# EasyEDA Pro project ProPrj_FISCuntrol Board2-CAN_2026-07-03.epro

# Schematic FISCuntrol Board2-CAN
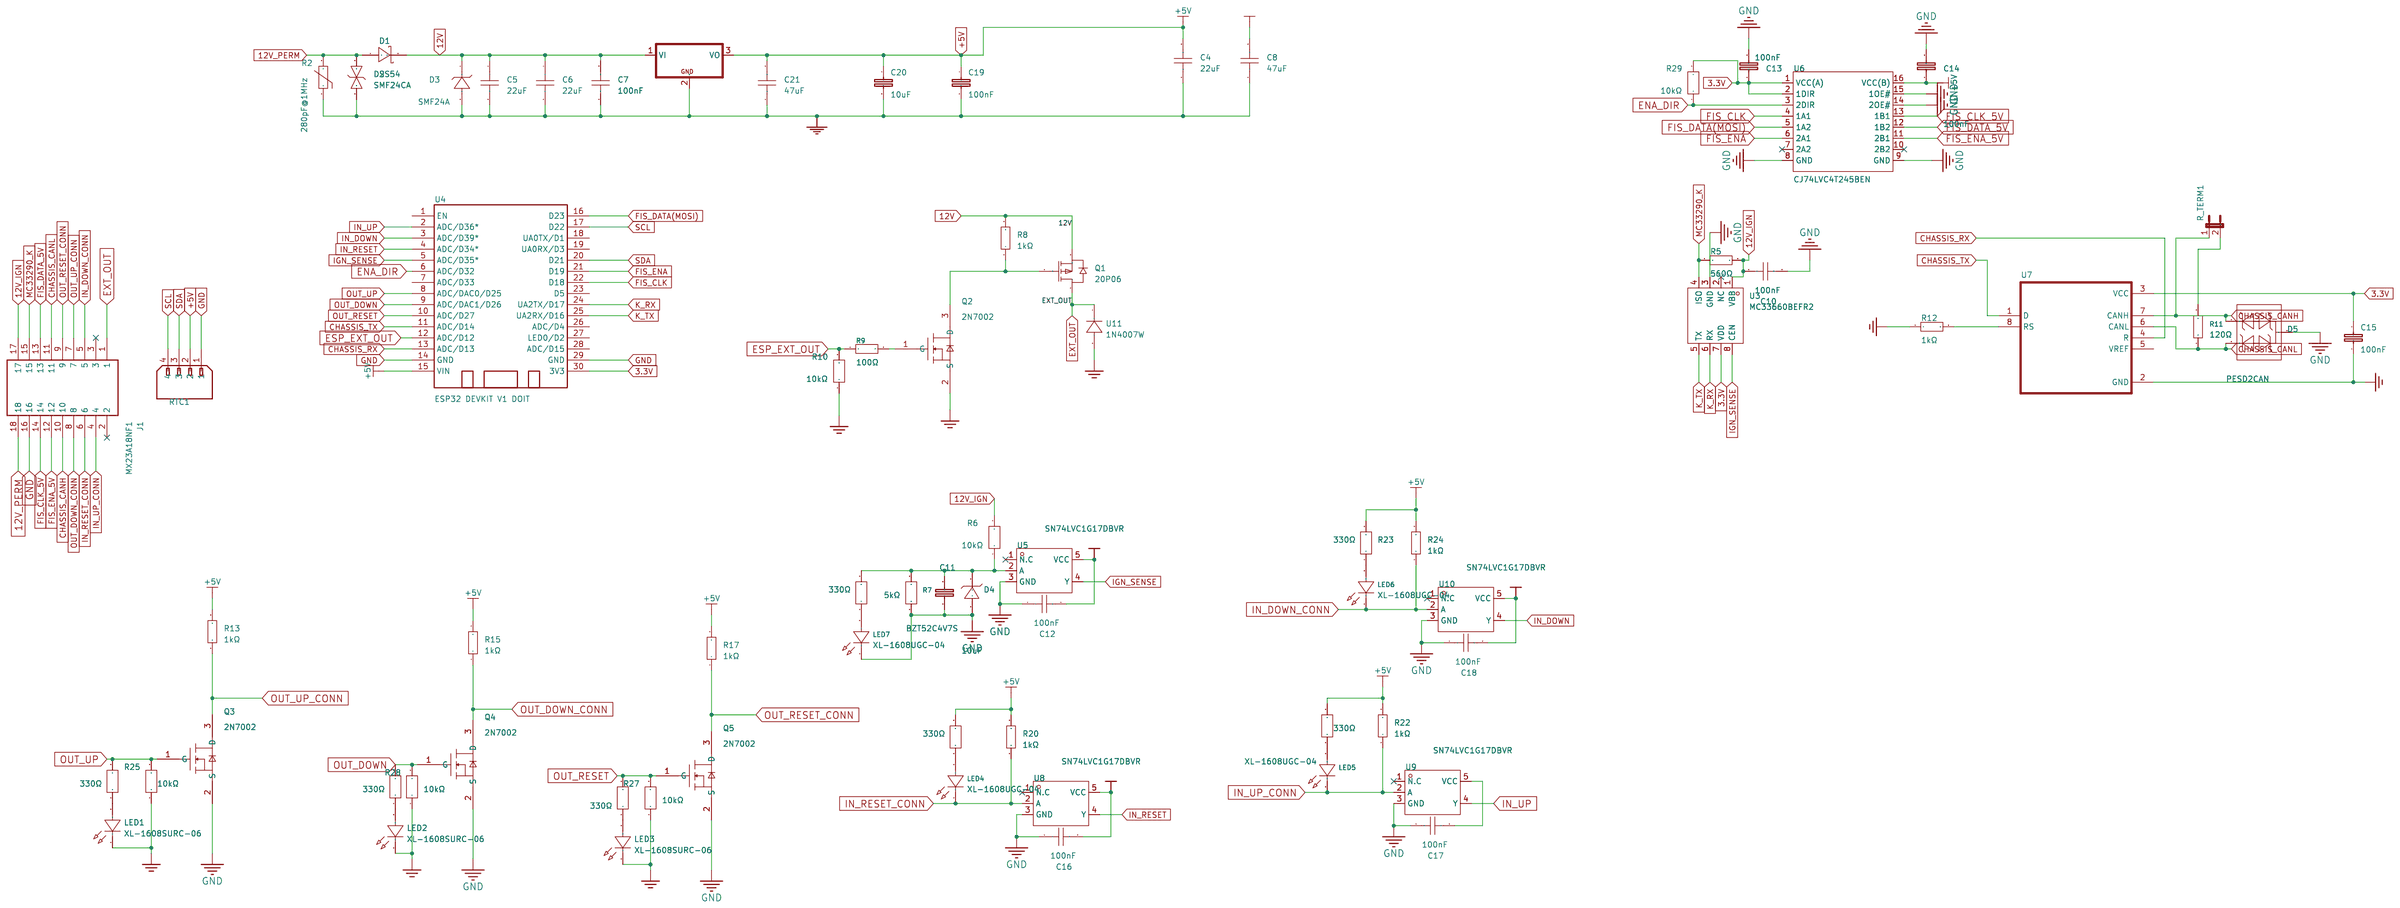
[diagram p0: schematic sheet]

## Parts
C4  22uF  [C0805]
C5  22uF  [C0805]
C6  22uF  [C0805]
C7  100nF  [C0603]
C8  47uF  [C0805]
C10  100nF  [C0603]
C11  10uF  [C0805]
C12  100nF  [C0603]
C13  100nF  [C0805]
C14  100nF  [C0805]
C15  100nF  [C0805]
C16  100nF  [C0603]
C17  100nF  [C0603]
C18  100nF  [C0603]
C19  100nF  [C0805]
C20  10uF  [C0805]
C21  47uF  [C0805]
D1  SS54  [SMA_L4.4-W2.8-LS5.4-R-RD]
D2  SMF24CA  [SOD-123FL_L2.8-W1.8-LS3.7-BI]
D3  SMF24A  [SOD-123FL_L2.7-W1.8-LS3.8-RD]
D4  BZT52C4V7S  [SOD-323_L1.8-W1.3-LS2.5-RD]
D5  PESD2CAN  [SOT-23-3_L2.9-W1.3-P1.90-LS2.4-BR]
IC1  L7805ABD2T-TR  [TO-263-2_L10.0-W9.2-P5.08-LS15.3-TL-CW]
J1  MX23A18NF1  [CONN-TH_18P-P2.50_MX23A18NF1]
LED1  XL-1608SURC-06  [LED0603-RD_RED]
LED2  XL-1608SURC-06  [LED0603-RD_RED]
LED3  XL-1608SURC-06  [LED0603-RD_RED]
LED4  XL-1608UGC-04  [LED0603-RD_GREEN]
LED5  XL-1608UGC-04  [LED0603-RD_GREEN]
LED6  XL-1608UGC-04  [LED0603-RD_GREEN]
LED7  XL-1608UGC-04  [LED0603-RD_GREEN]
Q1  20P06  [TO-252-2_L6.6-W6.1-P4.57-LS9.9-BR-CW]
Q2  2N7002  [SOT-23-3_L2.9-W1.3-P1.90-LS2.4-BR]
Q3  2N7002  [SOT-23-3_L2.9-W1.3-P1.90-LS2.4-BR]
Q4  2N7002  [SOT-23-3_L2.9-W1.3-P1.90-LS2.4-BR]
Q5  2N7002  [SOT-23-3_L2.9-W1.3-P1.90-LS2.4-BR]
R2  280pF@1MHz  [R0805]
R5  560Ω  [R0603]
R6  10kΩ  [R0603]
R7  5kΩ  [R0603]
R8  1kΩ  [R0603]
R9  100Ω  [R0603]
R10  10kΩ  [R0603]
R11  120Ω  [R0603]
R12  1kΩ  [R0603]
R13  1kΩ  [R0603]
R14  330Ω  [R0603]
R15  1kΩ  [R0603]
R16  330Ω  [R0603]
R17  1kΩ  [R0603]
R18  330Ω  [R0603]
R19  330Ω  [R0603]
R20  1kΩ  [R0603]
R21  330Ω  [R0603]
R22  1kΩ  [R0603]
R23  330Ω  [R0603]
R24  1kΩ  [R0603]
R25  10kΩ  [R0603]
R27  10kΩ  [R0603]
R28  10kΩ  [R0603]
R29  10kΩ  [R0603]
R30  330Ω  [R0603]
R_TERM1  PZ254V-11-02P  [HDR-TH_2P-P2.54-V-M]
RTC1  B4B-XH-A(LF)(SN)  [CONN-TH_B4B-XH-A-LF-SN]
U3  MC33660BEFR2  [SOIC-8_L5.0-W4.0-P1.27-LS6.0-BL]
U4  ESP32 DEVKIT V1 DOIT  [DOIT-ESP32-DEVKIT-V1]
U5  SN74LVC1G17DBVR  [SOT-23-5_L3.0-W1.5-P0.95-LS2.8-BL]
U6  CJ74LVC4T245BEN  [TSSOP-16_L5.0-W4.4-P0.65-LS6.4-BL-1]
U7  SN65HVD230DR  [SOIC-8_L4.9-W3.9-P1.27-LS6.0-BL]
U8  SN74LVC1G17DBVR  [SOT-23-5_L3.0-W1.5-P0.95-LS2.8-BL]
U9  SN74LVC1G17DBVR  [SOT-23-5_L3.0-W1.5-P0.95-LS2.8-BL]
U10  SN74LVC1G17DBVR  [SOT-23-5_L3.0-W1.5-P0.95-LS2.8-BL]
U11  1N4007W  [SOD-123FL_L2.7-W1.8-LS3.7-RD]

## Library data of the parts
C4-C6 = HGC0805R5226M350NSLJ: Capacitance: Tolerance:±20% Tolerance:±20% Voltage Rated: Temperature Coefficient:; LCSC Part Name: 22uF ±20% 35V; Supplier Part: C22367832; Manufacturer: Chinocera(华瓷); Supplier Footprint: 0805; JLCPCB Part Class: Extended Part; Datasheet: https://atta.szlcsc.com/upload/public/pdf/source/20240326/E9E9157D170E907C889ABA1F54A94302.pdf; Supplier: LCSC; Tolerance: ±20%; Standardization Check: false
C7 C10 C12 C16-C18 = CL10B104KB8NNNC: Capacitance:100nF Tolerance:±10% Tolerance:±10% Voltage Rating:50V Temperature Coefficient:X7R; LCSC Part Name: 100nF ±10% 50V; Supplier Part: C1591; Manufacturer: SAMSUNG(三星); Supplier Footprint: 0603; JLCPCB Part Class: Extended Part; Datasheet: https://item.szlcsc.com/datasheet/CL10B104KB8NNNC/1943.html; Supplier: LCSC; Tolerance: ±10%; Voltage Rating: 50V; Temperature Coefficient: X7R
C8 C21 = CL21A476MPYNNWE: Capacitance:47uF Tolerance:±20% Tolerance:±20% Voltage Rating:10V Temperature Coefficient:X5R; LCSC Part Name: 47uF ±20% 10V; Supplier Part: C5596752; Manufacturer: SAMSUNG(三星); Supplier Footprint: 0805; JLCPCB Part Class: Extended Part; Datasheet: https://item.szlcsc.com/datasheet/CL21A476MPYNNWE/6515219.html; Supplier: LCSC; Tolerance: ±20%; Voltage Rating: 10V; Temperature Coefficient: X5R
C11 C20 = CL21A106KAYNNNE_C15850: Capacitance: Tolerance:±10% Tolerance:±10% Voltage Rated: Temperature Coefficient:; LCSC Part Name: 10uF ±10% 25V; Supplier Part: C15850; Manufacturer: SAMSUNG(三星); Manufacturer Part: CL21A106KAYNNNE; Supplier Footprint: 0805; JLCPCB Part Class: Basic Part; Datasheet: https://atta.szlcsc.com/upload/public/pdf/source/20160218/1457707763339.pdf; Supplier: LCSC; Tolerance: ±10%
C13-C15 C19 = CT41G-0805-2X1-50V-0.1μF-K(N): Capacitance:100nF Tolerance:±10% Tolerance:±10% Voltage Rating:50V Temperature Coefficient:-; LCSC Part Name: 100nF ±10% 50V; Supplier Part: C126469; Manufacturer: TORCH(火炬); Supplier Footprint: 0805; JLCPCB Part Class: Extended Part; Datasheet: https://atta.szlcsc.com/upload/public/pdf/source/20171225/C150708_15141883600121203188.pdf; Supplier: LCSC; Tolerance: ±10%; Voltage Rating: 50V
D1 = SS54_C22452: Diode Configuration:Independent Type Forward Voltage (Vf@If):550mV@5A Reverse Voltage (Vr):40V Rectified Current:5A Reverse Leakage Current (Ir):1mA@40V; LCSC Part Name: 电压:40V 电流:5A; Supplier Part: C22452; Manufacturer: MDD(辰达半导体); Supplier Footprint: SMA(DO-214AC); JLCPCB Part Class: Basic Part; Datasheet: https://atta.szlcsc.com/upload/public/pdf/source/20240710/73DFBB65C1883B895E62D589679033DF.pdf; Supplier: LCSC; Diode Configuration: Independent Type; Forward Voltage (Vf@If): 550mV@5A; Reverse Voltage (Vr): 40V; Rectified Current: 5A; Reverse Leakage Current (Ir): 1mA@40V
D2 = SMF24CA_C353294: Reverse Stand-Off Voltage (Vrwm):24V Maximum Clamping Voltage:38.9V Peak Pulse Current (Ipp)@10/1000us:5.1A Breakdown Voltage:26.7V Reverse Leakage Current (Ir):1uA Type:TVS; Supplier Part: C353294; Manufacturer: 晶导微电子; Supplier Footprint: SOD-123FL; JLCPCB Part Class: Extended Part; Datasheet: https://atta.szlcsc.com/upload/public/pdf/source/20201106/C438024_76561727B84E8C9F41A4B4461A8AA838.pdf; Supplier: LCSC; Reverse Stand-Off Voltage (Vrwm): 24V; Maximum Clamping Voltage: 38.9V; Peak Pulse Current (Ipp)@10/1000us: 5.1A; Breakdown Voltage: 26.7V; Reverse Leakage Current (Ir): 1uA; Type: TVS
D3 = SMF24A_C19077514: Polarity:Unidirectional Reverse Stand-Off Voltage (Vrwm):24V Clamping Voltage:38.9V Peak Pulse Current (Ipp):5.1A@10/1000us Peak Pulse Power Dissipation (Ppp):200W@10/1000us Voltage - Breakdown:29.5V Reverse Leakage Current (Ir):1uA Number of Channels:1.0; LCSC Part Name: 单向TVS 24V截止 峰值浪涌电流：5.1A@10/1000us; Supplier Part: C19077514; Manufacturer: R+O(宏嘉诚); Supplier Footprint: SOD-123FL; JLCPCB Part Class: Extended Part; Datasheet: https://item.szlcsc.com/datasheet/SMF24A/20275599.html; Supplier: LCSC; Polarity: Unidirectional; Reverse Stand-Off Voltage (Vrwm): 24V; Clamping Voltage: 38.9V; Peak Pulse Current (Ipp): 5.1A@10/1000us; Peak Pulse Power Dissipation (Ppp): 200W@10/1000us; Voltage - Breakdown: 29.5V; Reverse Leakage Current (Ir): 1uA; Number of Channels: 1; Operating Temperature: -55℃~+150℃; level of protection: IEC 61000-4-2; Type: TVS
D4 = BZT52C4V7S_C353517: Diode Configuration:Independent Zener Voltage(Nom):4.7V Reverse Leakage Current (Ir):3uA@2V Zener Voltage(Range):4.4V~5V Zener Voltage(Range):4.4V~5V Pd - Power Dissipation:200mW Impedance(Zzt):80Ω Operating Junction Temperature Range:-55℃~+150℃ Operating; LCSC Part Name: 独立式 耐压:4.7V 电流:3uA@2V; Supplier Part: C353517; Manufacturer: 晶导微电子; Supplier Footprint: SOD-323; JLCPCB Part Class: Extended Part; Datasheet: https://item.szlcsc.com/datasheet/BZT52C4V7S/329266.html; Supplier: LCSC; Diode Configuration: Independent; Zener Voltage(Nom): 4.7V; Reverse Leakage Current (Ir): 3uA@2V; Zener Voltage(Range): 4.4V~5V; Pd - Power Dissipation: 200mW; Impedance(Zzt): 80Ω; Operating Junction Temperature Range: -55℃~+150℃
D5 = PESD2CAN_C907830: Polarity:Bidirectional Reverse Stand-Off Voltage (Vrwm):24V Clamping Voltage:50V Peak Pulse Current (Ipp):5.5A@8/20us Peak Pulse Power Dissipation (Ppp):250W@8/20us Voltage - Breakdown:32V Reverse Leakage Current (Ir):80nA Number of Channels:2 Operating T; LCSC Part Name: 丝印为6Rt 双向ESD 24V截止 峰值浪涌电流：5.5A@8/20us; Supplier Part: C907830; Manufacturer: TECH PUBLIC(台舟); Supplier Footprint: SOT-23; JLCPCB Part Class: Extended Part; Datasheet: https://item.szlcsc.com/datasheet/PESD2CAN/973917.html; Supplier: LCSC; Polarity: Bidirectional; Reverse Stand-Off Voltage (Vrwm): 24V; Clamping Voltage: 50V; Peak Pulse Current (Ipp): 5.5A@8/20us; Peak Pulse Power Dissipation (Ppp): 250W@8/20us; Voltage - Breakdown: 32V; Reverse Leakage Current (Ir): 80nA; Number of Channels: 2; Operating Temperature: -55℃~+125℃; level of protection: IEC 61000-4-2；IEC 61000-4-4；IEC 61000-4-5; Type: ESD; Junction Capacitance: 17pF
IC1 = L7805ABD2T-TR: Output Type:Fixed Maximum Input Voltage:35V Output Voltage:5V Output Voltage:5V Output Current:1.5A Power Supply Rejection Ratio (PSRR):68dB@(120Hz) Dropout Voltage:2V@(1A) standby current:6mA Feature:Short-Circuit  Protection；Thermal Protection(TSD) Oper; LCSC Part Name: 正稳压器IC; Supplier Part: C86206; Manufacturer: ST(意法半导体); Supplier Footprint: TO-263-2; JLCPCB Part Class: Extended Part; Datasheet: https://atta.szlcsc.com/upload/public/pdf/source/20191219/C472632_C0855675BBC73B8C8E44EE1325AAD56A.pdf; Supplier: LCSC; Output Type: Fixed; Maximum Input Voltage: 35V; Output Voltage: 5V; Output Current: 1.5A; Power Supply Rejection Ratio (PSRR): 68dB@(120Hz); Dropout Voltage: 2V@(1A); standby current: 6mA; Feature: Short-Circuit  Protection；Thermal Protection(TSD); Operating Temperature: -40℃~+125℃; Output Polarity: Positive electrode; Number of Outputs: 1
J1 = MX23A18NF1: Supplier Part: C2977290; Manufacturer: JAE(日本航空电子); Supplier Footprint: 插件; JLCPCB Part Class: Extended Part; Datasheet: https://item.szlcsc.com/datasheet/MX23A18NF1/3386696.html; Supplier: LCSC
LED1-LED3 = XL-1608SURC-06: Lamp Holder Type:1.6mm x 0.8mm square LED Illumination Color:Red Voltage - Forward(Vf):2.3V Voltage - Forward(Vf):2.3V Power(Watts):50mW Forward Current:20mA Wavelength - Dominant:620nm~630nm Wavelength - Dominant:620nm~630nm Peak Wavelength:625nm Peak Wa; LCSC Part Name: 0603红色贴片式发光二极管; Supplier Part: C965799; Manufacturer: XINGLIGHT(成兴光); Supplier Footprint: 0603; JLCPCB Part Class: Extended Part; Datasheet: https://item.szlcsc.com/datasheet/XL-1608SURC-06/1051408.html; Supplier: LCSC; Lamp Holder Type: 1.6mm x 0.8mm square LED; Illumination Color: Red; Voltage - Forward(Vf): 2.3V; Power(Watts): 50mW; Forward Current: 20mA; Wavelength - Dominant: 620nm~630nm; Peak Wavelength: 625nm; Diode Configuration: Discrete Diode; Lens Color: Water Clear; Luminous Intensity: 225mcd; Viewing Angle: 120°; Mounting Style: Top-mount; Operating Temperature: -40℃~+85℃
LED4-LED7 = XL-1608UGC-04: Lamp Holder Type:1.6mm x 0.8mm square LED Illumination Color:Emerald Green Voltage - Forward(Vf):3.3V Voltage - Forward(Vf):3.3V Power(Watts):70mW Forward Current:20mA Wavelength - Dominant:515nm~535nm Wavelength - Dominant:515nm~535nm Peak Wavelength:525; LCSC Part Name: 0603翠绿贴片式发光二极管; Supplier Part: C965804; Manufacturer: XINGLIGHT(成兴光); Supplier Footprint: 0603; JLCPCB Part Class: Extended Part; Datasheet: https://item.szlcsc.com/datasheet/XL-1608UGC-04/1051413.html; Supplier: LCSC; Lamp Holder Type: 1.6mm x 0.8mm square LED; Illumination Color: Emerald Green; Voltage - Forward(Vf): 3.3V; Power(Watts): 70mW; Forward Current: 20mA; Wavelength - Dominant: 515nm~535nm; Peak Wavelength: 525nm; Diode Configuration: Discrete Diode; Lens Color: Water Clear; Luminous Intensity: 810mcd; Viewing Angle: 120°; Mounting Style: Top-mount; Operating Temperature: -40℃~+85℃
Q1 = 20P06: Type:1 Piece P-Channel Drain Source Voltage (Vdss):60V Continuous Drain Current (Id): Drain Source On Resistance (RDS(on)@Vgs,Id):48mΩ Gate Threshold Voltage (Vgs(th)@Id):2.5V; LCSC Part Name: 1个P沟道 耐压:60V 电流:20A; Supplier Part: C18164394; Manufacturer: HL(富海微); Supplier Footprint: TO-252; JLCPCB Part Class: Extended Part; Datasheet: https://atta.szlcsc.com/upload/public/pdf/source/20231012/DDB4F5E9C77D3DD288E1321309E3ABAC.pdf; Supplier: LCSC; Type: 1 Piece P-Channel; Drain Source Voltage (Vdss): 60V; Drain Source On Resistance (RDS(on)@Vgs,Id): 48mΩ; Gate Threshold Voltage (Vgs(th)@Id): 2.5V
Q2-Q5 = 2N7002_C916396: Number:1 N-channel Drain to Source Voltage:60V Current - Continuous Drain(Id):115mA RDS(on):1.7Ω@5V Pd - Power Dissipation:200mW Gate Threshold Voltage (Vgs(th)):2.5V Gate Charge(Qg):- Input Capacitance(Ciss):50pF Reverse Transfer Capacitance (Crss@Vds):5; LCSC Part Name: 1个N沟道 耐压:60V 电流:115mA; Supplier Part: C916396; Manufacturer: JSMSEMI(杰盛微); Supplier Footprint: SOT-23; JLCPCB Part Class: Extended Part; Datasheet: https://item.szlcsc.com/datasheet/2N7002/990892.html; Supplier: LCSC; Number: 1 N-channel; Drain to Source Voltage: 60V; Current - Continuous Drain(Id): 115mA; RDS(on): 1.7Ω@5V; Pd - Power Dissipation: 200mW; Gate Threshold Voltage (Vgs(th)): 2.5V; Input Capacitance(Ciss): 50pF; Reverse Transfer Capacitance (Crss@Vds): 5pF; Operating Temperature: -55℃~+150℃
R2 = FPV201209E260PKT: Varistor Voltage:36V Varistor Voltage:36V Clamping Voltage:63V Maximum DC Volts:26V Maximum AC Volts:18.4V Peak Current:100A Energy:0.3J Energy:0.3J Capacitance:280pF@1MHz Rated Wattage:-; LCSC Part Name: 钳位电压63V 0.3焦耳 0805压敏电阻; Supplier Part: C2991545; Manufacturer: FH(风华); Supplier Footprint: 0805; JLCPCB Part Class: Extended Part; Datasheet: https://atta.szlcsc.com/upload/public/pdf/source/20181030/C304296_DDDABF933F96CAF6D0EBDDE0D30269D0.pdf; Supplier: LCSC; Varistor Voltage: 36V; Clamping Voltage: 63V; Maximum DC Volts: 26V; Maximum AC Volts: 18.4V; Peak Current: 100A; Energy: 0.3J
R5 = 0603WAF5600T5E: Type:Thick Film Resistor Resistance:560Ω Tolerance:±1% Tolerance:±1% Power(Watts):100mW Voltage-Supply(Max):75V Temperature Coefficient:±100ppm/℃ Temperature Coefficient:±100ppm/℃ Operating Temperature:-55℃~+155℃ Operating Temperature:-55℃~+155℃; LCSC Part Name: 560Ω ±1% 100mW 厚膜电阻; Supplier Part: C23204; Manufacturer: UNI-ROYAL(厚声); Supplier Footprint: 0603; JLCPCB Part Class: Basic Part; Datasheet: https://item.szlcsc.com/datasheet/0603WAF5600T5E/23931.html; Supplier: LCSC; Type: Thick Film Resistor; Tolerance: ±1%; Power(Watts): 100mW; Voltage-Supply(Max): 75V; Temperature Coefficient: ±100ppm/℃; Operating Temperature: -55℃~+155℃
R6 R10 R25 R27-R29 = FRC0603J103 TS: Type:Thick Film Resistor Resistance:10kΩ Tolerance:±5% Tolerance:±5% Power(Watts):100mW Voltage-Supply(Max):75V Temperature Coefficient:±100ppm/℃ Temperature Coefficient:±100ppm/℃ Operating Temperature:-55℃~+155℃ Operating Temperature:-55℃~+155℃; LCSC Part Name: 10kΩ ±5% 100mW 厚膜电阻; Supplier Part: C2930027; Manufacturer: FOJAN(富捷); Supplier Footprint: 0603; JLCPCB Part Class: Extended Part; Datasheet: https://item.szlcsc.com/datasheet/FRC0603J103%2520TS/3266960.html; Supplier: LCSC; Type: Thick Film Resistor; Tolerance: ±5%; Power(Watts): 100mW; Voltage-Supply(Max): 75V; Temperature Coefficient: ±100ppm/℃; Operating Temperature: -55℃~+155℃
R7 = RTT035001FTP: Type:Thick Film Resistor Resistance:5kΩ Tolerance:±1% Tolerance:±1% Power(Watts):100mW Voltage-Supply(Max):75V Temperature Coefficient:±100ppm/℃ Temperature Coefficient:±100ppm/℃ Operating Temperature:-55℃~+155℃ Operating Temperature:-55℃~+155℃; LCSC Part Name: 厚膜电阻 5kΩ ±1% 100mW; Supplier Part: C166926; Manufacturer: RALEC(旺诠); Supplier Footprint: 0603; JLCPCB Part Class: Extended Part; Datasheet: https://item.szlcsc.com/datasheet/RTT035001FTP/178309.html; Supplier: LCSC; Type: Thick Film Resistor; Tolerance: ±1%; Power(Watts): 100mW; Voltage-Supply(Max): 75V; Temperature Coefficient: ±100ppm/℃; Operating Temperature: -55℃~+155℃
R8 R12 R13 R15 R17 = 0603WAF1001T5E: Type:Thick Film Resistors Resistance:1kΩ Tolerance:±1% Tolerance:±1% Power(Watts): Overload Voltage (Max): Temperature Coefficient:±100ppm/℃ Temperature Coefficient:±100ppm/℃ Operating Temperature Range:-55℃~+155℃ Operating Temperature Range:-55℃~+155℃; LCSC Part Name: 1kΩ ±1% 100mW 厚膜电阻; Supplier Part: C21190; Manufacturer: UNI-ROYAL(厚声); Supplier Footprint: 0603; JLCPCB Part Class: Basic Part; Datasheet: https://atta.szlcsc.com/upload/public/pdf/source/20200306/C422600_1E6D84923E4A46A82E41ADD87F860B5C.pdf; Supplier: LCSC; Type: Thick Film Resistors; Tolerance: ±1%; Temperature Coefficient: ±100ppm/℃; Operating Temperature Range: -55℃~+155℃
R9 = 0603WAJ0101T5E: Type:Thick Film Resistor Resistance:100Ω Tolerance:±5% Tolerance:±5% Power(Watts):100mW Voltage-Supply(Max):75V Temperature Coefficient:±100ppm/℃ Temperature Coefficient:±100ppm/℃ Operating Temperature:-55℃~+155℃ Operating Temperature:-55℃~+155℃; LCSC Part Name: 100Ω ±5% 100mW 厚膜电阻; Supplier Part: C25201; Manufacturer: UNI-ROYAL(厚声); Supplier Footprint: 0603; JLCPCB Part Class: Extended Part; Datasheet: https://item.szlcsc.com/datasheet/0603WAJ0101T5E/25944.html; Supplier: LCSC; Type: Thick Film Resistor; Tolerance: ±5%; Power(Watts): 100mW; Voltage-Supply(Max): 75V; Temperature Coefficient: ±100ppm/℃; Operating Temperature: -55℃~+155℃
R11 = 0603WAF1200T5E: Type:Thick Film Resistors Resistance: Tolerance:±1% Tolerance:±1% Power(Watts): Overload Voltage (Max): Temperature Coefficient:±100ppm/℃ Temperature Coefficient:±100ppm/℃ Operating Temperature Range:-55℃~+155℃ Operating Temperature Range:-55℃~+155℃; LCSC Part Name: 120Ω ±1% 100mW 厚膜电阻; Supplier Part: C22787; Manufacturer: UNI-ROYAL(厚声); Supplier Footprint: 0603; JLCPCB Part Class: Basic Part; Datasheet: https://atta.szlcsc.com/upload/public/pdf/source/20200306/C422600_1E6D84923E4A46A82E41ADD87F860B5C.pdf; Supplier: LCSC; Type: Thick Film Resistors; Tolerance: ±1%; Temperature Coefficient: ±100ppm/℃; Operating Temperature Range: -55℃~+155℃
R14 R16 R18 R19 R21 R23 R30 = FRC0603J331 TS: Type:Thick Film Resistor Resistance:330Ω Tolerance:±5% Tolerance:±5% Power(Watts):100mW Voltage-Supply(Max):75V Temperature Coefficient:±100ppm/℃ Temperature Coefficient:±100ppm/℃ Operating Temperature:-55℃~+155℃ Operating Temperature:-55℃~+155℃; LCSC Part Name: 330Ω ±5% 100mW 厚膜电阻; Supplier Part: C2907152; Manufacturer: FOJAN(富捷); Supplier Footprint: 0603; JLCPCB Part Class: Extended Part; Supplier: LCSC; Type: Thick Film Resistor; Tolerance: ±5%; Power(Watts): 100mW; Voltage-Supply(Max): 75V; Temperature Coefficient: ±100ppm/℃; Operating Temperature: -55℃~+155℃
R20 R22 R24 = 0603WAF1001T5E: Type:Thick Film Resistors Resistance:1kΩ Tolerance:±1% Tolerance:±1% Power(Watts): Overload Voltage (Max): Temperature Coefficient:±100ppm/℃ Temperature Coefficient:±100ppm/℃ Operating Temperature Range:-55℃~+155℃ Operating Temperature Range:-55℃~+155℃; LCSC Part Name: 1kΩ ±1% 100mW 厚膜电阻; Supplier Part: C21190; Manufacturer: UNI-ROYAL(厚声); Supplier Footprint: 0603; JLCPCB Part Class: Basic Part; Datasheet: https://atta.szlcsc.com/upload/public/pdf/source/20200306/C422600_1E6D84923E4A46A82E41ADD87F860B5C.pdf; Supplier: LCSC; Type: Thick Film Resistors; Tolerance: ±1%; Temperature Coefficient: ±100ppm/℃; Operating Temperature Range: -55℃~+155℃; Check: true
R_TERM1 = PZ254V-11-02P: Pin Structure:1x2P Pitch:2.54mm Row Spacing:- Circluar Pins/Square Pins:Policy Mounting Type:Straight Number of Rows:Single Row Number of Pins:2P Current Rating:- Voltage Rating (Max):- Length of Mating Pin:6mm Insulation Height:2.5mm Length of End Connec; LCSC Part Name: 1x2P 间距:2.54mm 方针 直插; Supplier Part: C492401; Manufacturer: XFCN(兴飞); Supplier Footprint: 插件,P=2.54mm; JLCPCB Part Class: Extended Part; Datasheet: https://atta.szlcsc.com/upload/public/pdf/source/20200309/C492401_A812433581A9B211A7FFA413ADDFF0E5.pdf; Supplier: LCSC; Pin Structure: 1x2P; Pitch: 2.54mm; Circluar Pins/Square Pins: Policy; Mounting Type: Straight; Number of Rows: Single Row; Number of Pins: 2P; Length of Mating Pin: 6mm; Insulation Height: 2.5mm; Length of End Connection Pin: 3mm; Contact Material: Brass; Operating Temperature: -40℃~+105℃; Color: Black
RTC1 = B4B-XH-A(LF)(SN): Pins Structure:1x4P Pitch:2.5mm Mounting Type:Through Hole Reference Series:XH Number of Pins:4P Number of Rows:1 Number of PINs Per Row:4 Row Spacing:- Current Rating:3A Contact Material:Brass Contact Plating:Tin Operating Temperature:-25℃~+85℃ Operating; LCSC Part Name: 1x4P 间距:2.5mm 直插 系列:XH; Supplier Part: C144395; Manufacturer: JST; Supplier Footprint: 插件,P=2.5mm; JLCPCB Part Class: Extended Part; Datasheet: https://item.szlcsc.com/datasheet/B4B-XH-A(LF)(SN)/155727.html; Supplier: LCSC; Pins Structure: 1x4P; Pitch: 2.5mm; Mounting Type: Through Hole; Reference Series: XH; Number of Pins: 4P; Number of Rows: 1; Number of PINs Per Row: 4; Current Rating: 3A; Contact Material: Brass; Contact Plating: Tin; Operating Temperature: -25℃~+85℃; Voltage Rating: 250V; Plastic Material: PA66; Flame Retardant Rating: UL94V-0; Supplementary Features: K Pin; Color: White; Z-Height of the Board: 7mm; X-Length of Bottom Edge on Board (Spacing Line): 12.4mm; Y-Width of Bottom Edge on Board: 5.75mm
U3 = MC33660BEFR2: Voltage - Supply:8V~18V Voltage - Supply:8V~18V; LCSC Part Name: ISO K线串行链路接口; Supplier Part: C2652912; Manufacturer: NXP(恩智浦); Supplier Footprint: SOIC-8; JLCPCB Part Class: Extended Part; Datasheet: https://www.nxp.com/docs/en/data-sheet/MC33660.pdf; Supplier: LCSC; Voltage - Supply: 8V~18V
U4 = ESP32 DEVKIT V1 DOIT
U5 U8-U10 = SN74LVC1G17DBVR_C19829662: Supplier Part: C19829662; Manufacturer: TECH PUBLIC(台舟); Supplier Footprint: SOT-23-5; JLCPCB Part Class: Extended Part; Datasheet: https://atta.szlcsc.com/upload/public/pdf/source/20240202/EAF8B4F29332307745EEFE11873F995E.pdf; Supplier: LCSC
U6 = CJ74LVC4T245BEN: Channel Type:Bidirectional Input Signal:- Output Signal:- Data Rate:- Voltage - Supply(VCCA):1.2V~5.5V Voltage - Supply(VCCA):1.2V~5.5V Voltage - Supply(VCCB):1.2V~5.5V Voltage - Supply(VCCB):1.2V~5.5V Number of Elements:2 Number of Circuits:2 Output Type; LCSC Part Name: 4位双电源电平转换收发器，具备三态输出和双向电平转换功能，可作两个2位或一个4位收发器，适用于低电压节点间转换; Supplier Part: C52145709; Manufacturer: CJ(江苏长电/长晶); Supplier Footprint: TSSOP-16; JLCPCB Part Class: Extended Part; Datasheet: https://item.szlcsc.com/datasheet/CJ74LVC4T245BEN/54945864.html; Supplier: LCSC; Channel Type: Bidirectional; Voltage - Supply(VCCA): 1.2V~5.5V; Voltage - Supply(VCCB): 1.2V~5.5V; Number of Elements: 2; Number of Circuits: 2; Output Type: Tri-State; Operating Temperature: -40℃~+125℃; Features: Power-off protection；Output enable high-impedance
U7 = SN65HVD230DR: Type:CANtransceiver Data Rate:1Mbps Voltage - Supply:- Voltage - Supply:- Current - Supply:- Operating Temperature:-40℃~+85℃ Operating Temperature:-40℃~+85℃; LCSC Part Name: 3.3-V CAN 收发器; Supplier Part: C12084; Manufacturer: TI(德州仪器); Supplier Footprint: SOIC-8; JLCPCB Part Class: Extended Part; Datasheet: https://www.ti.com/cn/lit/gpn/sn65hvd230; Supplier: LCSC; Type: CANtransceiver; Data Rate: 1Mbps; Operating Temperature: -40℃~+85℃
U11 = 1N4007W_C7528871: Diode Configuration:Independent Voltage - Forward(Vf@If):1.1V@1A Voltage - DC Reverse(Vr):1kV Current - Rectified:1A Reverse Leakage Current (Ir):10uA Non-Repetitive Peak Forward Surge Current:- Operating Junction Temperature Range:-65℃~+150℃ Operating Ju; LCSC Part Name: 1kV 1A; Supplier Part: C7528871; Manufacturer: MSKSEMI(美森科); Supplier Footprint: SOD-123FL; JLCPCB Part Class: Extended Part; Datasheet: https://item.szlcsc.com/datasheet/1N4007W/8628271.html; Supplier: LCSC; Diode Configuration: Independent; Voltage - Forward(Vf@If): 1.1V@1A; Voltage - DC Reverse(Vr): 1kV; Current - Rectified: 1A; Reverse Leakage Current (Ir): 10uA; Operating Junction Temperature Range: -65℃~+150℃

## Nets
3.3V: C8.2 C12.2 C13.1 C15.1 C16.2 C17.2 C18.2 R29.2 U3.7(VDD) U4.30(3V3) U5.5(VCC) U6.1(VCC(A)) U6.2(1DIR) U7.3(VCC) U8.5(VCC) U9.5(VCC) U10.5(VCC)
12V: C5.1 C6.1 C7.2 D1.2(K) D3.1(K) IC1.1(VI) Q1.3(S) R8.2
12V_IGN: C10.1 J1.17 R5.2 R6.2 U3.1(VBB)
12V_PERM: D1.1(A) D2.2 J1.18 R2.2
+5V: C4.2 C14.1 C19.1 C20.1 C21.2 IC1.3(VO) R13.2 R15.2 R17.2 R19.2 R20.2 R21.2 R22.2 R23.2 R24.2 RTC1.2 U4.15(VIN) U6.16(VCC(B))
GND: C4.1 C5.2 C6.2 C7.1 C8.1 C10.2 C11.1 C12.1 C13.2 C14.2 C15.2 C16.1 C17.1 C18.1 C19.2 C20.2 C21.1 D2.1 D3.2(A) D4.2(A) D5.3 IC1.2(GND) J1.16 LED1.1(K) LED2.1(K) LED3.1(K) LED7.1(K) Q2.2(S) Q3.2(S) Q4.2(S) Q5.2(S) R2.1 R7.1 R10.1 R12.1 R25.1 R27.1 R28.1 RTC1.1 U3.3(GND) U4.14(GND) U4.29(GND) U5.3(GND) U6.8(GND) U6.9(GND) U6.14(2OE#) U6.15(1OE#) U7.2(GND) U8.3(GND) U9.3(GND) U10.3(GND) U11.2(A)
CHASSIS_CANH: D5.1 J1.10 R_TERM1.1 U7.7(CANH)
CHASSIS_CANL: D5.2 J1.11 R11.1 U7.6(CANL)
CHASSIS_RX: U4.13(ADC/D13) U7.4(R)
CHASSIS_TX: U4.11(ADC/D14) U7.1(D)
ENA_DIR: R29.1 U4.6(ADC/D32) U6.3(2DIR)
ESP_EXT_OUT: R9.1 R10.2 U4.12(ADC/D12)
EXT_OUT: J1.1 Q1.2(D) U11.1(K)
FIS_CLK: U4.22(D18) U6.4(1A1)
FIS_CLK_5V: J1.14 U6.13(1B1)
FIS_DATA(MOSI): U4.16(D23) U6.5(1A2)
FIS_DATA_5V: J1.13 U6.12(1B2)
FIS_ENA: U4.21(D19) U6.6(2A1)
FIS_ENA_5V: J1.12 U6.11(2B1)
IGN_SENSE: U3.8(CEN) U4.5(ADC/D35*) U5.4(Y)
IN_DOWN: U4.3(ADC/D39*) U10.4(Y)
IN_DOWN_CONN: J1.5 LED6.1(K) R24.1 U10.2(A)
IN_RESET: U4.4(ADC/D34*) U8.4(Y)
IN_RESET_CONN: J1.6 LED4.1(K) R20.1 U8.2(A)
IN_UP: U4.2(ADC/D36*) U9.4(Y)
IN_UP_CONN: J1.4 LED5.1(K) R22.1 U9.2(A)
K_RX: U3.6(RX) U4.24(UA2TX/D17)
K_TX: U3.5(TX) U4.25(UA2RX/D16)
MC33290_K: J1.15 R5.1 U3.4(ISO)
OUT_DOWN: Q4.1(G) R16.2 R28.2 U4.9(ADC/DAC1/D26)
OUT_DOWN_CONN: J1.8 Q4.3(D) R15.1
OUT_RESET: Q5.1(G) R18.2 R27.2 U4.10(ADC/D27)
OUT_RESET_CONN: J1.9 Q5.3(D) R17.1
OUT_UP: Q3.1(G) R14.2 R25.2 U4.8(ADC/DAC0/D25)
OUT_UP_CONN: J1.7 Q3.3(D) R13.1
SCL: RTC1.4 U4.17(D22)
SDA: RTC1.3 U4.20(D21)
$1N2670: R12.2 U7.8(RS)
$1N2676: R11.2 R_TERM1.2
$1N3031: C11.2 D4.1(K) R6.1 R7.2 R30.2 U5.2(A)
$1N10020: Q1.1(G) Q2.3(D) R8.1
$1N11639: Q2.1(G) R9.2
$1N29123: LED6.2(A) R23.1
$1N29127: LED5.2(A) R21.1
$1N29131: LED4.2(A) R19.1
$1N35050: LED1.2(A) R14.1
$1N35143: LED2.2(A) R16.1
$1N35226: LED3.2(A) R18.1
$1N45097: LED7.2(A) R30.1

Not connected (* = marked no-connect by the designer): J1 2* 3*; U3 2(NC)*; U4 1(EN) 7(ADC/D33) 18(UA0TX/D1) 19(UA0RX/D3) 23(D5) 26(ADC/D4) 27(LED0/D2) 28(ADC/D15); U5 1(N.C)*; U6 7(2A2)* 10(2B2)*; U7 5(VREF); U8 1(N.C)*; U9 1(N.C)*; U10 1(N.C)*

# Board PCB1
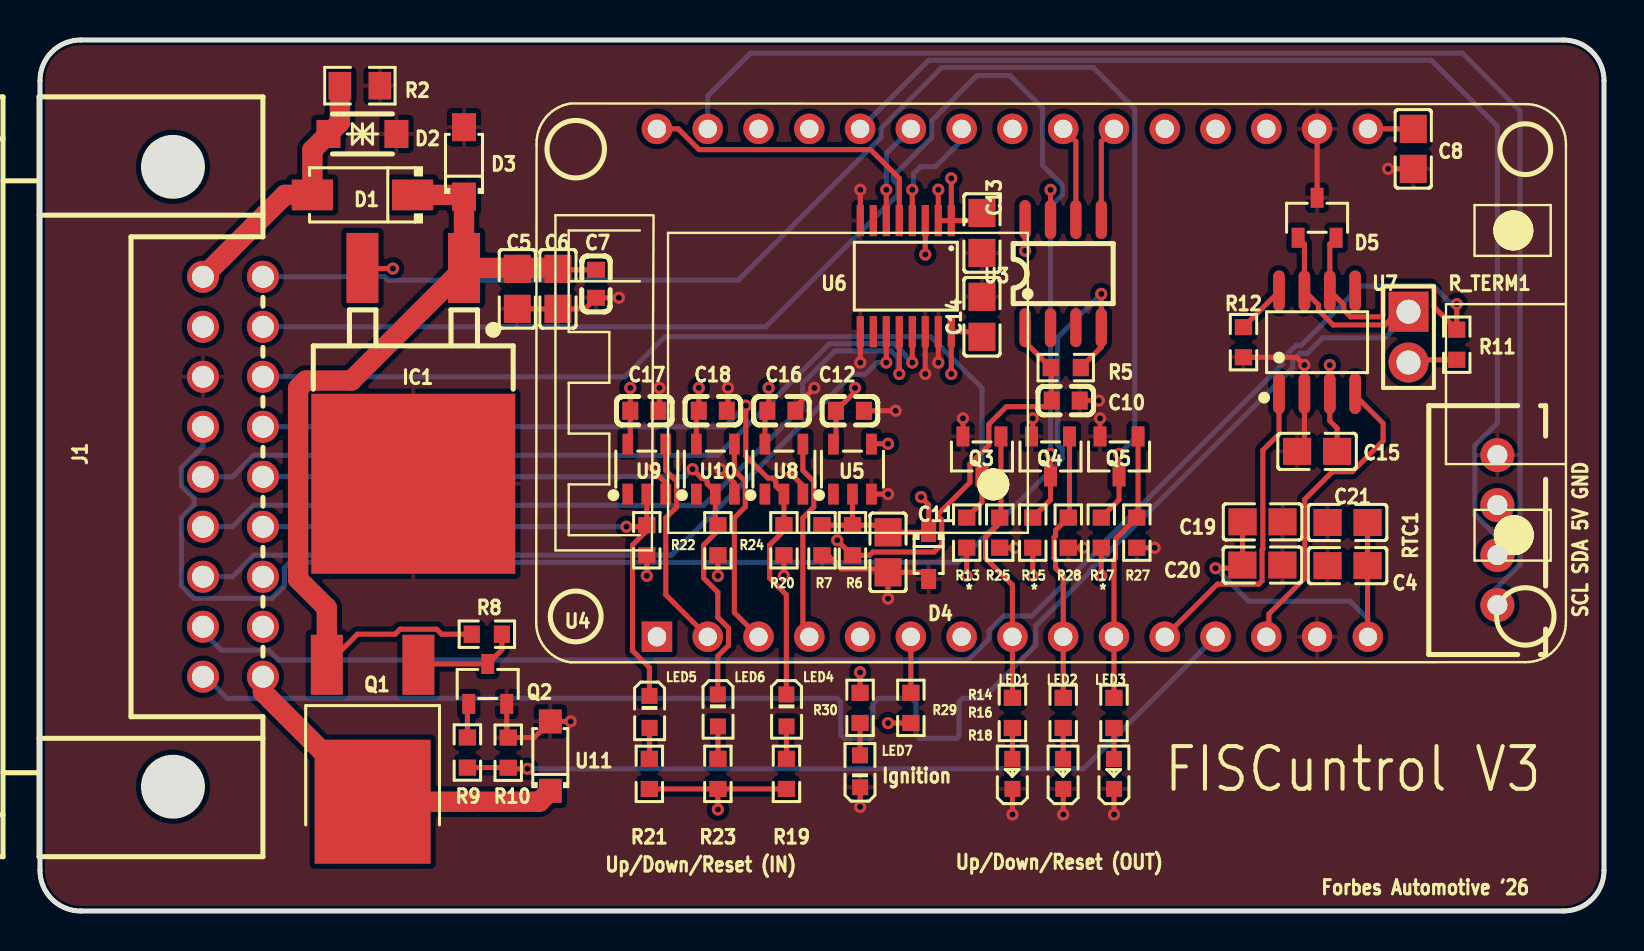
[diagram p1: board, top side]
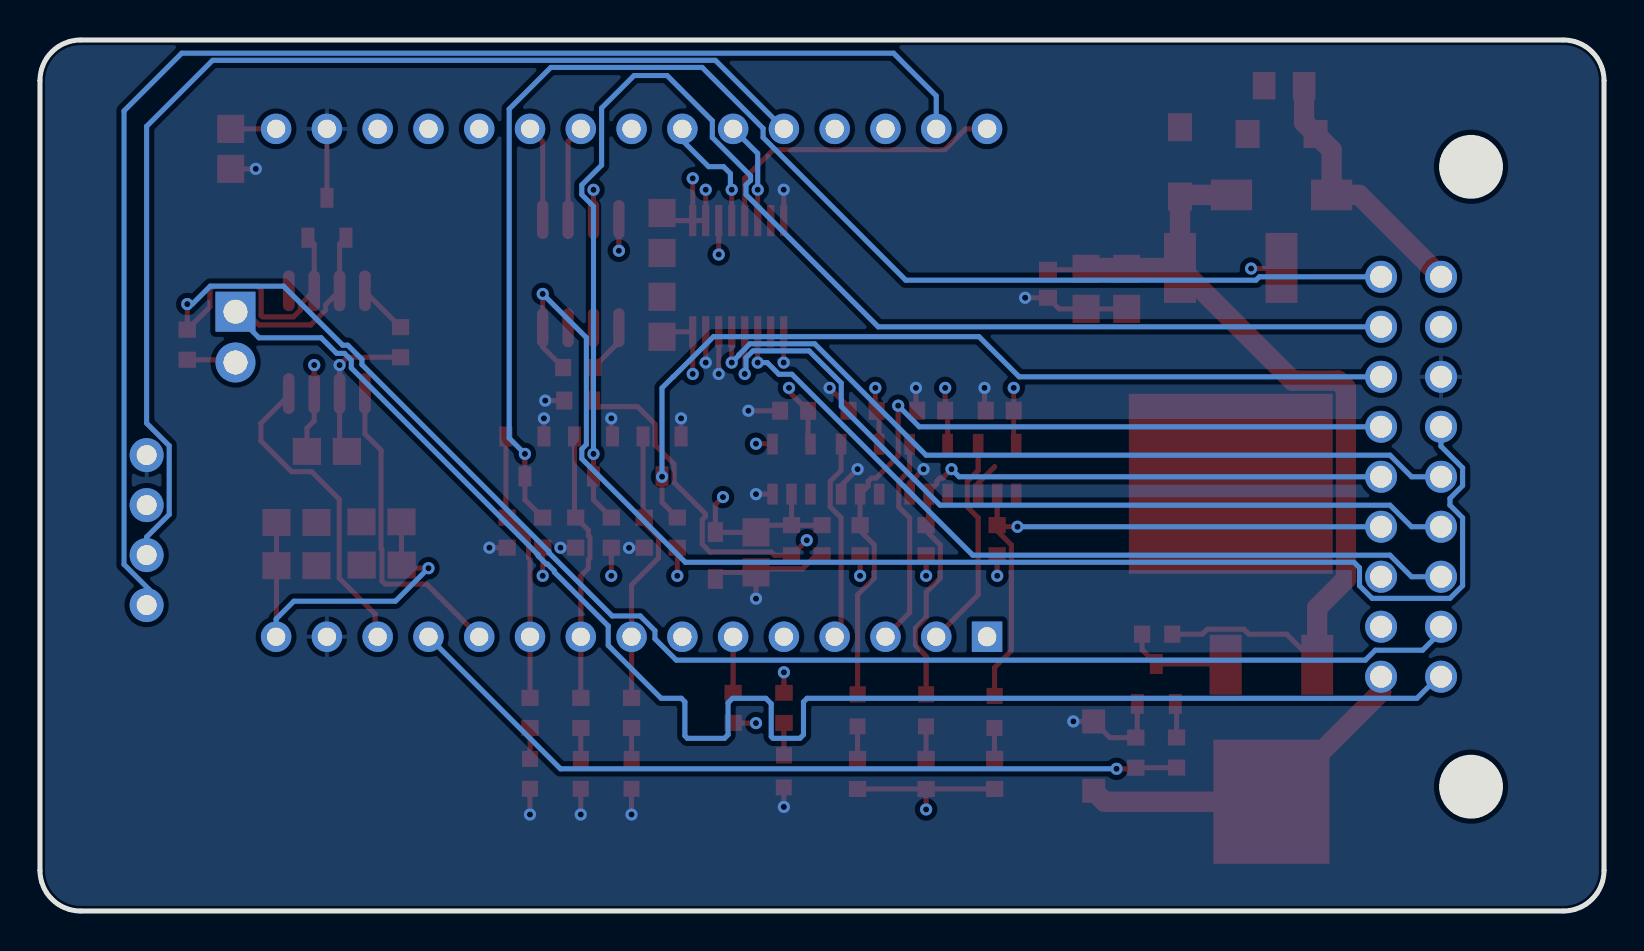
[diagram p2: board, bottom side, seen from below]

Outline 78.23 x 43.56 mm; copper layers: Top Layer, PWR, GND, Bottom Layer. Coordinates in mm from the lower left corner of the outline.
Outline path: 0,41.53 0,2.03 arc(0.6,0.6) 2.03,0 76.2,0 arc(77.64,0.6) 78.23,2.03 78.23,41.53 arc(77.64,42.97) 76.2,43.56 2.03,43.56 arc(0.6,42.97) 0,41.53
Stack: Top Layer 0.035mm Outer layer thickness 1oz / Dielectric1 0.2104mm 7628 RC49% 8.6mil / PWR 0.0152mm Inner layer thickness / Dielectric2 1.065mm 1.1mm H/HOZ Copper / GND 0.0152mm Inner layer thickness / Dielectric3 0.2104mm 7628 RC49% 8.6mil / Bottom Layer 0.035mm Outer layer thickness 1oz

## Design rules (mm)
net CHASSIS_CANH: DP1
net CHASSIS_CANL: DP1
net CHASSIS_TX: DP2
net CHASSIS_RX: DP2
net K_RX: DP3
net K_TX: DP3
template: JLCPCB Capability(Two Layers Board)
spacing copperThickness1oz (default): track to track 0.102, other pairs 0.152 to 0.3
spacing copperThickness2oz: track to track 0.203, other pairs 0.152 to 0.3
track width copperThickness1oz (default): min 0.127, default 0.254, max 2.54
track width copperThickness2oz: min 0.203, default 0.254, max 2.54
differential pair differentialPair (default): width min 0.127, default 0.254, max 2.54; gap min 0.152, default 0.152
via viaSize (default): diameter min 0.5, default 0.61, max 10; hole min 0.3, default 0.305, max 6.3

## Placement (name value [footprint] x y rotation side)
C4  22uF  [C0805]  65.4 17.27 0 top
C5  22uF  [C0805]  23.88 31.12 270 top
C6  22uF  [C0805]  25.91 31.12 270 top
C7  100nF  [C0603]  27.81 31.37 90 top
C8  47uF  [C0805]  68.69 38.12 90 top
C10  100nF  [C0603]  51.31 25.53 0 top
C11  10uF  [C0805]  42.42 17.94 90 top
C12  100nF  [C0603]  40.51 25.02 180 top
C13  100nF  [C0805]  47.12 33.91 270 top
C14  100nF  [C0805]  47.12 29.72 90 top
C15  100nF  [C0805]  63.88 22.99 180 top
C16  100nF  [C0603]  37.08 25.02 180 top
C17  100nF  [C0603]  30.23 25.02 180 top
C18  100nF  [C0603]  33.65 25.02 180 top
C19  100nF  [C0805]  61.15 19.46 0 top
C20  10uF  [C0805]  61.14 17.3 0 top
C21  47uF  [C0805]  65.4 19.43 0 top
D1  SS54  [SMA_L4.4-W2.8-LS5.4-R-RD]  16.13 35.81 180 top
D2  SMF24CA  [SOD-123FL_L2.8-W1.8-LS3.7-BI]  16.13 38.86 180 top
D3  SMF24A  [SOD-123FL_L2.7-W1.8-LS3.8-RD]  21.21 37.47 90 top
D4  BZT52C4V7S  [SOD-323_L1.8-W1.3-LS2.5-RD]  44.45 17.78 270 top
D5  PESD2CAN  [SOT-23-3_L2.9-W1.3-P1.90-LS2.4-BR]  63.88 34.67 270 top
IC1  L7805ABD2T-TR  [TO-263-2_L10.0-W9.2-P5.08-LS15.3-TL-CW]  18.67 26.76 270 top
J1  MX23A18NF1  [CONN-TH_18P-P2.50_MX23A18NF1]  9.65 21.72 270 top
LED1  XL-1608SURC-06  [LED0603-RD_RED]  48.64 6.86 90 top
LED2  XL-1608SURC-06  [LED0603-RD_RED]  51.18 6.86 90 top
LED3  XL-1608SURC-06  [LED0603-RD_RED]  53.72 6.86 90 top
LED4  XL-1608UGC-04  [LED0603-RD_GREEN]  37.34 10.03 270 top
LED5  XL-1608UGC-04  [LED0603-RD_GREEN]  30.49 9.96 270 top
LED6  XL-1608UGC-04  [LED0603-RD_GREEN]  33.91 10.03 270 top
LED7  XL-1608UGC-04  [LED0603-RD_GREEN]  41.02 6.99 90 top
Q1  20P06  [TO-252-2_L6.6-W6.1-P4.57-LS9.9-BR-CW]  16.64 8.89 90 top
Q2  2N7002  [SOT-23-3_L2.9-W1.3-P1.90-LS2.4-BR]  22.4 11.36 270 top
Q3  2N7002  [SOT-23-3_L2.9-W1.3-P1.90-LS2.4-BR]  47.12 22.73 90 top
Q4  2N7002  [SOT-23-3_L2.9-W1.3-P1.90-LS2.4-BR]  50.55 22.73 90 top
Q5  2N7002  [SOT-23-3_L2.9-W1.3-P1.90-LS2.4-BR]  53.98 22.73 90 top
R2  280pF@1MHz  [R0805]  16 41.28 180 top
R5  560Ω  [R0603]  51.31 27.18 180 top
R6  10kΩ  [R0603]  40.64 18.54 270 top
R7  5kΩ  [R0603]  39.12 18.54 90 top
R8  1kΩ  [R0603]  22.35 13.84 180 top
R9  100Ω  [R0603]  21.38 7.93 90 top
R10  10kΩ  [R0603]  23.42 7.92 270 top
R11  120Ω  [R0603]  70.87 28.32 270 top
R12  1kΩ  [R0603]  60.2 28.45 90 top
R13  1kΩ  [R0603]  46.36 18.92 270 top
R14  330Ω  [R0603]  48.64 9.91 90 top
R15  1kΩ  [R0603]  49.66 18.92 270 top
R16  330Ω  [R0603]  51.18 9.91 90 top
R17  1kΩ  [R0603]  53.09 18.92 270 top
R18  330Ω  [R0603]  53.72 9.91 90 top
R19  330Ω  [R0603]  37.34 6.86 270 top
R20  1kΩ  [R0603]  37.21 18.54 270 top
R21  330Ω  [R0603]  30.48 6.86 270 top
R22  1kΩ  [R0603]  30.35 18.54 270 top
R23  330Ω  [R0603]  33.91 6.86 270 top
R24  1kΩ  [R0603]  33.91 18.54 270 top
R25  10kΩ  [R0603]  48.01 18.92 90 top
R27  10kΩ  [R0603]  54.86 18.92 90 top
R28  10kΩ  [R0603]  51.43 18.92 90 top
R29  10kΩ  [R0603]  43.56 10.16 270 top
R30  330Ω  [R0603]  41.02 10.16 90 top
R_TERM1  PZ254V-11-02P  [HDR-TH_2P-P2.54-V-M]  68.45 28.7 270 top
RTC1  B4B-XH-A(LF)(SN)  [CONN-TH_B4B-XH-A-LF-SN]  72.9 19.05 90 top
U3  MC33660BEFR2  [SOIC-8_L5.0-W4.0-P1.27-LS6.0-BL]  51.18 31.88 0 top
U4  ESP32 DEVKIT V1 DOIT  [DOIT-ESP32-DEVKIT-V1]  30.86 13.72 90 top
U5  SN74LVC1G17DBVR  [SOT-23-5_L3.0-W1.5-P0.95-LS2.8-BL]  40.64 22.1 0 top
U6  CJ74LVC4T245BEN  [TSSOP-16_L5.0-W4.4-P0.65-LS6.4-BL-1]  43.31 31.75 180 top
U7  SN65HVD230DR  [SOIC-8_L4.9-W3.9-P1.27-LS6.0-BL]  63.88 28.45 0 top
U8  SN74LVC1G17DBVR  [SOT-23-5_L3.0-W1.5-P0.95-LS2.8-BL]  37.21 22.1 0 top
U9  SN74LVC1G17DBVR  [SOT-23-5_L3.0-W1.5-P0.95-LS2.8-BL]  30.35 22.1 0 top
U10  SN74LVC1G17DBVR  [SOT-23-5_L3.0-W1.5-P0.95-LS2.8-BL]  33.78 22.1 0 top
U11  1N4007W  [SOD-123FL_L2.7-W1.8-LS3.7-RD]  25.53 7.75 90 top

## Footprints (pads in the part's own frame, mm; a bottom-side part is the same pattern mirrored in y, then rotated)
C0603
  rect 0.8x0.9 smd: 1(-0.7,0) 2(0.7,0)
C0805
  rect 1.41x1.35 smd: 1(-1,0) 2(1,0)
CONN-TH_18P-P2.50_MX23A18NF1
  round 1.6 hole 1.1: 1(10,1.5) 2(7.5,1.5) 3(5,1.5) 4(2.5,1.5) 5(0,1.5) 6(-2.5,1.5) 7(-5,1.5) 8(-7.5,1.5) 9(-10,1.5) 10(10,-1.5) 11(7.5,-1.5) 12(5,-1.5) 13(2.5,-1.5) 14(0,-1.5) 15(-2.5,-1.5) 16(-5,-1.5) 17(-7.5,-1.5) 18(-10,-1.5)
CONN-TH_B4B-XH-A-LF-SN
  round 1.7 hole 1: 1(3.75,0) 2(1.25,0) 3(-1.25,0) 4(-3.75,0)
DOIT-ESP32-DEVKIT-V1
  rect 1.524x1.524 hole 0.96x0.914: 1(0,0)
  round 1.524 hole 0.914: 2(0,-2.54) 3(0,-5.08) 4(0,-7.62) 5(0,-10.16) 6(0,-12.7) 7(0,-15.24) 8(0,-17.78) 9(0,-20.32) 10(0,-22.86) 11(0,-25.4) 12(0,-27.94) 13(0,-30.48) 14(0,-33.02) 15(0,-35.56) 16(25.4,0) 17(25.4,-2.54) 18(25.4,-5.08) 19(25.4,-7.62) 20(25.4,-10.16) 21(25.4,-12.7) 22(25.4,-15.24) 23(25.4,-17.78) 24(25.4,-20.32) 25(25.4,-22.86) 26(25.4,-25.4) 27(25.4,-27.94) 28(25.4,-30.48) 29(25.4,-33.02) 30(25.4,-35.56)
HDR-TH_2P-P2.54-V-M
  rect 2x2 hole 1.2: 1(-1.27,0)
  round 2 hole 1.2: 2(1.27,0)
LED0603-RD_GREEN
  rect 0.8x0.8 smd: 1(-0.799,-0.004) 2(0.799,0.004)
LED0603-RD_RED
  rect 0.8x0.8 smd: 1(-0.749,-0.004) 2(0.749,0.004)
R0603
  rect 0.806x0.864 smd: 1(-0.753,0) 2(0.753,0)
R0805
  rect 1.133x1.377 smd: 1(-1,0) 2(1,0)
SMA_L4.4-W2.8-LS5.4-R-RD
  rect 2.062x1.539 smd: 1(2.503,0) 2(-2.503,0)
SOD-123FL_L2.7-W1.8-LS3.7-RD
  rect 1.2x1.15 smd: 1(-1.735,0) 2(1.735,0)
SOD-123FL_L2.7-W1.8-LS3.8-RD
  rect 1.4x1.2 smd: 1(-1.735,0) 2(1.735,0)
SOD-123FL_L2.8-W1.8-LS3.7-BI
  rect 1.2x1.4 smd: 1(-1.7,0) 2(1.7,0)
SOD-323_L1.8-W1.3-LS2.5-RD
  rect 1x0.75 smd: 1(-1.173,0) 2(1.173,0)
SOIC-8_L4.9-W3.9-P1.27-LS6.0-BL
  oval 0.588x2.045 smd: 1(-1.905,-2.57) 2(-0.635,-2.57) 3(0.635,-2.57) 4(1.905,-2.57) 5(1.905,2.57) 6(0.635,2.57) 7(-0.635,2.57) 8(-1.905,2.57)
SOIC-8_L5.0-W4.0-P1.27-LS6.0-BL
  oval 0.569x1.95 smd: 1(-1.905,-2.705) 2(-0.635,-2.705) 3(0.635,-2.705) 4(1.905,-2.705) 5(1.905,2.705) 6(0.635,2.705) 7(-0.635,2.705) 8(-1.905,2.705)
SOT-23-3_L2.9-W1.3-P1.90-LS2.4-BR
  rect 1x0.65 smd: 1(1,-0.95) 2(1,0.95) 3(-1,0)
SOT-23-5_L3.0-W1.5-P0.95-LS2.8-BL
  rect 0.532x1.045 smd: 1(-0.95,-1.25) 2(0,-1.25) 3(0.95,-1.25) 4(0.95,1.25) 5(-0.95,1.25)
TO-252-2_L6.6-W6.1-P4.57-LS9.9-BR-CW
  rect 3x1.6 smd: 1(3.424,-2.29) 3(3.424,2.29)
  rect 6.2x5.8 smd: 2(-3.424,0)
TO-263-2_L10.0-W9.2-P5.08-LS15.3-TL-CW
  rect 3.5x1.6 smd: 1(-5.397,2.54) 3(-5.397,-2.54)
  rect 9x10.2 smd: 2(5.397,0)
TSSOP-16_L5.0-W4.4-P0.65-LS6.4-BL-1
  rect 0.364x1.56 smd: 1(-2.275,-2.78) 2(-1.625,-2.78) 3(-0.975,-2.78) 4(-0.325,-2.78) 5(0.325,-2.78) 6(0.975,-2.78) 7(1.625,-2.78) 8(2.275,-2.78) 9(2.275,2.78) 10(1.625,2.78) 11(0.975,2.78) 12(0.325,2.78) 13(-0.325,2.78) 14(-0.975,2.78) 15(-1.625,2.78) 16(-2.275,2.78)

## Nets
As in the schematic.

Pads without a net: J1 2 3; U3 2; U4 1 7 18 19 23 26 27 28; U5 1; U6 7 10; U7 5; U8 1; U9 1; U10 1

## Via types
v1: diameter 0.61, hole 0.305, Top Layer to Bottom Layer, 66 vias

## Routing (per net, layer and track width the routed paths; a pad name or vN(x,y) marks a point on that pad's centre or on a via; arc(x,y) is an arc through that point)
3.3V: length 27.2
  Top Layer w0.254: U10.5 32.83,24.9 C18.2 v1(32.95,26.16) ; U6.1 U6.2 v1(44.93,36.07) ; U6.1 46.74,34.53 C13.1 ; U6.1 v1(45.58,36.64) ; v1(42.42,9.4) 43.17,9.4 43.18,9.41 R29.2 ; C8.2 U4.30 ; U8.5 36.26,24.9 C16.2 36.45,25.08 v1(36.45,26.16) ; v1(64.52,27.31) U7.3 64.52,24.51 64.88,24.15 C15.1 ; v1(40.77,26.16) 40.77,25.97 C12.2 39.81,23.47 U5.5 ; v1(29.53,26.16) C17.2 29.53,23.47 U9.5 ; U3.7 v1(50.55,36.07)
12V: length 46.1
  Top Layer w0.254: R8.2 20.09,13.84 19.84,14.09 18.01,14.09 17.76,13.84 15.88,13.84 Q1.3 ; C7.2 25.95,32.07
  Top Layer w1.016: IC1.1 25.86,32.16 C6.1 ; IC1.1 15.58,26.53 13.3,26.53 12.91,26.14 12.91,16.59 14.35,15.16 Q1.3 ; IC1.1 21.21,32.16 D3.1 21.12,35.81 D1.2
12V_IGN: length 66.1
  Top Layer w0.254: U3.1 49.28,28.46 R5.2 50.61,27.12 C10.1 50.3,25.22 48.34,25.22 47.46,24.35 47.46,23.3 46.51,22.35 46.51,21.43 44.94,19.86 44.94,19.73 45.1,19.57 45.1,18.34 44.72,17.96 41.66,17.96 41.49,17.79 R6.2 40.63,17.79 v1(39.88,18.54)
  PWR w0.254: v1(39.88,18.54) 29.08,18.54 18.01,29.61 18.01,31.66 18.24,31.89 18.24,32.37 17.89,32.72 17.41,32.72 17.07,32.37 17.07,30.98 11.73,25.64 10.7,25.64 10.07,26.27 10.07,27.3 J1.17
12V_PERM: length 13.2
  Top Layer w1.016: R2.2 15,39.44 D2.2 13.63,38.06 D1.1 12.25,35.81 J1.18
+5V: length 120.4
  Top Layer w0.254: IC1.3 16.16,32.13 v1(17.65,32.13) ; R24.2 v1(33.91,16.76) ; R13.2 v1(46.36,16.76) ; C21.2 C4.2 66.4,13.73 U4.15 ; R22.2 v1(30.35,16.76) ; R23.2 R19.2 ; R23.2 v1(33.91,5.08) ; R23.2 R21.2 ; v1(58.8,17.15) 59.99,17.15 C20.1 60.15,17.31 C19.1 ; C14.1 46.86,28.97 U6.16 v1(45.58,26.86) ; R20.2 v1(37.21,16.76) ; R15.2 v1(49.66,16.76) ; R17.2 v1(53.09,16.76)
  PWR w0.254: v1(45.58,26.86) 45.58,17.54 v1(46.36,16.76) ; v1(33.91,16.76) 33.91,14.68 34.44,14.15 34.44,13.29 33.91,12.75 v1(33.91,5.08) ; v1(33.91,16.76) v1(30.35,16.76) 17.65,29.46 v1(17.65,32.13) ; v1(33.91,16.76) v1(37.21,16.76) v1(46.36,16.76) ; v1(46.36,16.76) v1(49.66,16.76) v1(53.09,16.76) 58.42,16.76 v1(58.8,17.15) ; U4.15 66.42,13.82 RTC1.2
  Bottom Layer w0.254: U4.15 66.42,14.61 65.53,15.49 60.45,15.49 v1(58.8,17.15)
GND: length 58.6
  Top Layer w0.254: v1(38.73,26.16) 37.78,25.21 C16.1 ; LED7.1 v1(41.02,5.21) ; C10.2 v1(52.96,25.53) ; v1(49.66,24.64) 49.66,23.79 Q4.2 ; D5.3 U4.29 ; 51.18,5.98 v1(51.18,4.83) ; v1(30.99,26.16) 30.99,25.08 C17.1 ; R7.1 39.41,17.79 40.09,17.11 42.25,17.11 C11.1 ; U6.8 v1(41.03,36.07) ; D4.2 44.12,16.94 C11.1 ; U6.15 v1(44.93,27.43) ; U6.14 v1(44.28,26.86) ; v1(26.54,9.48) U11.2 24.72,8.67 R10.1 23.35,8.75 Q2.2 ; LED1.1 v1(48.64,4.83) ; U5.3 v1(42.42,20.85) ; U9.3 31.3,21.4 30.48,22.23 ; R12.1 62.86,27.69 v1(63.25,27.31) U7.2 63.25,23.35 C15.2 ; C18.1 34.42,25.08 v1(34.42,26.16) ; U6.9 v1(41.03,27.43) ; C11.1 v1(42.42,15.62) ; R27.1 v1(55.75,18.17) ; C8.1 v1(67.44,37.12) ; v1(37.34,22.1) 38.16,21.28 U8.3 ; Q5.2 v1(53.02,24.64) ; 41.21,25.02 v1(42.8,25.02) ; v1(34.04,22.1) 34.73,21.4 U10.3 ; 46.17,23.73 v1(46.17,24.64) ; C5.2 C6.2 27.26,30.12 C7.1 v1(28.96,30.67) ; 53.72,5.98 v1(53.72,4.83) ; R25.1 48.76,18.17 v1(48.77,18.16) ; R28.1 v1(52.2,18.17)
CHASSIS_CANH: length 86
  Top Layer w0.254: R_TERM1.1 67.93,29.97 67.27,29.31 64.68,29.31 63.94,30.05 63.94,30.32 63.25,31.02 63.25,33.36 D5.1
  Bottom Layer w0.254: J1.10 8.28,11.72 9.36,10.64 39.86,10.64 40.04,10.46 40.04,8.82 40.22,8.64 41.57,8.64 41.66,8.73 41.66,10.37 41.93,10.64 43.59,10.64 43.81,10.41 43.81,8.82 43.99,8.64 45.85,8.64 45.97,8.76 45.97,10.46 46.15,10.64 47.16,10.64 49.81,13.29 49.81,14.25 52.5,16.95 52.5,17.01 52.84,17.35 52.9,17.35 53.31,17.76 53.31,17.81 62.66,27.16 62.66,27.55 63,27.89 63.39,27.89 64.17,28.67 67.28,28.67 68.45,29.85 R_TERM1.1
CHASSIS_CANL: length 86
  Top Layer w0.254: v1(70.87,30.35) R11.1 69.73,30.21 69.73,31.09 69.57,31.25 67.34,31.25 67.17,31.09 67.17,29.79 67.1,29.72 65.55,29.72 65.21,30.05 65.21,30.32 64.52,31.02 64.52,33.36 D5.2
  Bottom Layer w0.254: J1.11 8.15,13.96 9.07,13.04 11.44,13.04 11.93,12.55 46.41,12.55 47.47,13.62 47.47,14.02 48.21,14.76 49.61,14.76 52.78,17.93 52.78,17.98 62.13,27.33 62.13,27.59 62.84,28.3 63.09,28.3 66.05,31.25 69.71,31.25 70.61,30.35 v1(70.87,30.35)
CHASSIS_RX: length 15.7
  Top Layer w0.254: U7.4 65.91,25.75 65.91,25.66 67.18,24.39 67.18,23.51 65.64,21.97 64.64,21.97 63.26,20.59 63.26,16.65 61.47,14.85 61.47,13.84 U4.13
CHASSIS_TX: length 15.7
  Top Layer w0.254: U4.11 58.89,16.35 60.96,16.35 61.13,16.51 61.13,18.06 61.17,18.1 61.17,23.05 61.98,23.86 U7.1
ENA_DIR: length 59.2
  Top Layer w0.254: U6.3 v1(44.28,32.83) ; U4.6 43.56,11.29
  PWR w0.254: U4.6 46.02,16.18 46.6,16.18 46.83,16.41 49.19,16.41 49.42,16.18 49.9,16.18 50.13,16.41 52.62,16.41 52.84,16.18 53.33,16.18 53.56,16.41 58.57,16.41 58.72,16.56 59.04,16.56 59.39,16.9 59.39,17.39 59.04,17.73 58.56,17.73 57.95,17.12 53.56,17.12 53.33,17.35 52.84,17.35 52.62,17.12 50.13,17.12 49.9,17.35 49.42,17.35 49.19,17.12 46.83,17.12 46.41,17.54 46.41,24.05 49.86,27.51 49.86,33.26 49.52,33.6 49.03,33.6 48.26,32.83 v1(44.28,32.83)
ESP_EXT_OUT: length 40.2
  Top Layer w0.254: R9.1 23.41,7.17 R10.2 23.47,7.11 v1(24.38,7.11)
  Bottom Layer w0.254: v1(24.38,7.11) 52.2,7.11 U4.12
EXT_OUT: length 17.6
  Top Layer w1.016: U11.1 24.98,5.47 Q1.2 11.15,10.95 J1.1
FIS_CLK: length 6
  Top Layer w0.254: U6.4 v1(43.63,36.07)
  Bottom Layer w0.254: v1(43.63,36.07) 43.7,36.14 43.7,36.88 44.04,37.23 44.79,37.23 46.1,38.54 U4.22
FIS_CLK_5V: length 40.2
  Top Layer w0.254: U6.13 v1(43.63,27.43)
  Bottom Layer w0.254: v1(43.63,27.43) 43.27,27.79 43.27,27.82 42.72,28.37 39.48,28.37 33.91,22.8 10.7,22.8 9.63,21.72 J1.14
FIS_DATA(MOSI): length 15.3
  Top Layer w0.254: U4.16 31.93,39.12 32.97,38.08 41.55,38.08 42.98,36.64 U6.5
FIS_DATA_5V: length 42.2
  Top Layer w0.254: U6.12 v1(42.98,26.86)
  Bottom Layer w0.254: v1(42.98,26.86) 42.92,26.92 42.92,27.67 42.57,28.01 39.76,28.01 38.15,26.4 38.15,25.24 33.21,20.3 10.7,20.3 9.63,19.22 J1.13
FIS_ENA: length 5.1
  Top Layer w0.254: U6.6 v1(42.33,36.07)
  Bottom Layer w0.254: v1(42.33,36.07) 42.33,37.89 U4.21
FIS_ENA_5V: length 40.2
  Top Layer w0.254: U6.11 v1(42.33,27.43)
  Bottom Layer w0.254: v1(42.33,27.43) 41.86,27.43 41.27,26.84 40.62,26.84 31.58,17.8 10.7,17.8 9.63,16.72 J1.12
IGN_SENSE: length 31.2
  Top Layer w0.254: U5.4 41.61,23.37 v1(42.42,23.37) ; U3.8 v1(49.28,33.02)
  PWR w0.254: v1(42.42,23.37) 41.91,23.88 41.91,26.88 41.75,27.05 41.75,27.67 42.09,28.01 45.25,28.01 46.52,26.74 48.46,26.74 48.64,26.92 48.64,32.39 v1(49.28,33.02)
  GND w0.254: v1(42.42,23.37) 41.02,21.97 U4.5
IN_DOWN: length 10.6
  Top Layer w0.254: U4.3 34.73,14.93 34.73,19.67 35.28,20.21 35.28,21.49 34.73,22.03 U10.4
IN_DOWN_CONN: length 34.5
  Top Layer w0.254: v1(32.64,22.1) 33.09,21.65 33.21,21.65 33.38,21.49 33.38,21.36 33.78,20.96 U10.2 33.78,19.42 33.91,19.3 33.91,19.02 33.2,18.31 33.2,16.65 33.91,15.94 33.91,14.68 34.44,14.15 34.44,13.29 33.91,12.75 LED6.1
  Bottom Layer w0.254: J1.5 32.26,21.72 v1(32.64,22.1)
IN_RESET: length 10.2
  Top Layer w0.254: U4.4 38.16,14.04 38.16,19.67 38.71,20.21 38.71,21.49 38.16,22.03 U8.4
IN_RESET_CONN: length 40.7
  Top Layer w0.254: LED4.1 37.33,15.81 36.5,16.65 36.5,18.31 37.33,19.14 37.33,19.17 R20.1 U8.2 36.81,21.25 36.81,21.49 36.64,21.65 36.41,21.65 35.31,22.75 v1(35.31,25.27)
  Bottom Layer w0.254: v1(35.31,25.27) 34.25,24.22 J1.6
IN_UP: length 11
  Top Layer w0.254: U9.4 31.3,22.03 31.85,21.49 31.85,20.21 31.3,19.67 31.3,15.81 U4.2
IN_UP_CONN: length 30.1
  Top Layer w0.254: R22.1 30.48,19.17 30.48,19.15 29.64,18.31 29.64,13.02 30.48,12.18 LED5.1 ; R22.1 U9.2 ; R22.1 30.27,19.22 v1(29.34,19.22)
  Bottom Layer w0.254: J1.4 v1(29.34,19.22)
K_RX: length 4.8
  Top Layer w0.254: U3.6 51.82,38.48 U4.24
K_TX: length 4.8
  Top Layer w0.254: U4.25 53.09,38.48 U3.5
MC33290_K: length 70
  Top Layer w0.254: R5.1 53.09,28.2 U3.4 v1(53.09,30.86)
  Bottom Layer w0.254: v1(53.09,30.86) 50.9,28.68 50.9,23.33 51.13,23.1 51.13,22.62 45.95,17.44 12.51,17.44 12.23,17.16 12.23,16.27 11.6,15.64 7.7,15.64 7.07,16.27 7.07,19.66 7.7,20.3 7.7,20.64 7.07,21.27 7.07,22.16 8.15,23.24 J1.15
OUT_DOWN: length 13.7
  Top Layer w0.254: 51.18,10.53 U4.9 51.18,16.76 50.8,17.15 50.8,17.58 50.72,17.65 50.72,18.69 50.8,18.76 50.8,19.04 R28.2 51.5,19.74 Q4.1
OUT_DOWN_CONN: length 67.7
  Top Layer w0.254: v1(50.55,22.86) Q4.3 50.55,20.57 R15.1
  Bottom Layer w0.254: J1.8 36.3,29.22 42.92,35.83 42.92,36.31 42.69,36.54 42.69,36.77 44.6,38.69 44.6,39.52 46.86,41.78 48.51,41.78 50.14,40.16 50.14,37.3 51.13,36.31 51.13,35.83 50.55,35.24 v1(50.55,22.86)
OUT_RESET: length 13.7
  Top Layer w0.254: Q5.1 54.92,19.74 R27.2 53.8,18.61 53.8,17.65 53.72,17.58 U4.10 53.72,10.53
OUT_RESET_CONN: length 70.3
  Top Layer w0.254: R17.1 53.98,20.57 Q5.3 v1(53.98,22.86)
  Bottom Layer w0.254: v1(53.98,22.86) 54.76,23.65 54.76,40.11 52.68,42.19 45.11,42.19 42.06,39.14 42.06,38.69 34.92,31.55 17.41,31.55 17.24,31.72 J1.9
OUT_UP: length 14
  Top Layer w0.254: R14.2 U4.8 48.64,16.3 47.3,17.65 47.3,18.69 48.01,19.4 R25.2 48.07,19.74 Q3.1
OUT_UP_CONN: length 44.7
  Top Layer w0.254: R13.1 47.12,20.44 Q3.3
  Bottom Layer w0.254: J1.7 29.25,26.72 31.26,28.72 44.54,28.72 46.55,26.72 46.56,26.72 47.12,26.16 v1(47.12,21.72)
SCL: length 69.6
  Bottom Layer w0.254: RTC1.4 72.77,15.43 72.77,16.08 74.03,17.33 74.03,40.01 71.14,42.9 35.53,42.9 33.4,40.77 U4.17
SDA: length 57
  Bottom Layer w0.254: U4.20 44.45,42.55 69.6,42.55 72.9,39.24 72.9,24.4 71.77,23.27 71.77,19.83 72.9,18.7 RTC1.3
$1N2670: length 2.6
  Top Layer w0.254: 61.98,31.02 61.98,30.98 R12.2
$1N2676: length 2.5
  Top Layer w0.254: R11.2 68.59,27.57 R_TERM1.2
$1N3031: length 20.4
  Top Layer w0.254: R6.1 42.06,19.3 C11.2 44.44,18.94 D4.1 44.45,20.32 v1(44.07,20.7) ; R6.1 R7.2 ; R6.1 U5.2 ; v1(41.02,11.94) R30.2
  GND w0.254: v1(44.07,20.7) 44.07,14.99 43.84,14.76 43.13,14.76 42.52,14.15 42.52,13.44 v1(41.02,11.94)
$1N10020: length 5.3
  Top Layer w0.254: Q1.1 18.97,12.36 Q2.3 23.11,13.07 R8.1
$1N11639: length 1.7
  Top Layer w0.254: 21.38,8.68 21.38,10.29 Q2.1
$1N29123: length 1.6
  Top Layer w0.254: R23.1 33.91,7.62 LED6.2
$1N29127: length 1.6
  Top Layer w0.254: LED5.2 30.49,7.62 R21.1
$1N29131: length 1.6
  Top Layer w0.254: R19.1 37.34,9.23 LED4.2
$1N35050: length 1.5
  Top Layer w0.254: LED1.2 48.64,7.61 R14.1
$1N35143: length 1.5
  Top Layer w0.254: 51.18,9.03 51.18,7.48 51.18,7.48
$1N35226: length 1.5
  Top Layer w0.254: 53.72,7.48 53.72,7.48 53.72,9.03
$1N45097: length 1.6
  Top Layer w0.254: LED7.2 41.02,7.79 R30.1

## Copper pours and planes (outline as drawn; the poured copper is in the pictures)
3.3V on PWR: -4.7,49.66 85.34,49.66 85.34,-5.46 -4.7,-5.46
GND on Top Layer: -1.52,44.58 79.63,44.58 79.63,-0.51 -1.52,-0.51
GND on Bottom Layer: -1.91,45.72 79.63,45.72 79.63,-1.4 -1.91,-1.4
GND on GND: -2.79,45.34 80.52,45.34 80.52,-1.52 -2.79,-1.52

## Text on the board
Top Silkscreen Layer: * | Up/Down/Reset (IN) | Ignition | Up/Down/Reset (OUT) | Forbes Automotive '26 | SCL SDA 5V GND | FISCuntrol V3
